# EAGLE design botboardpro-rev1 (EAGLE 4.13)
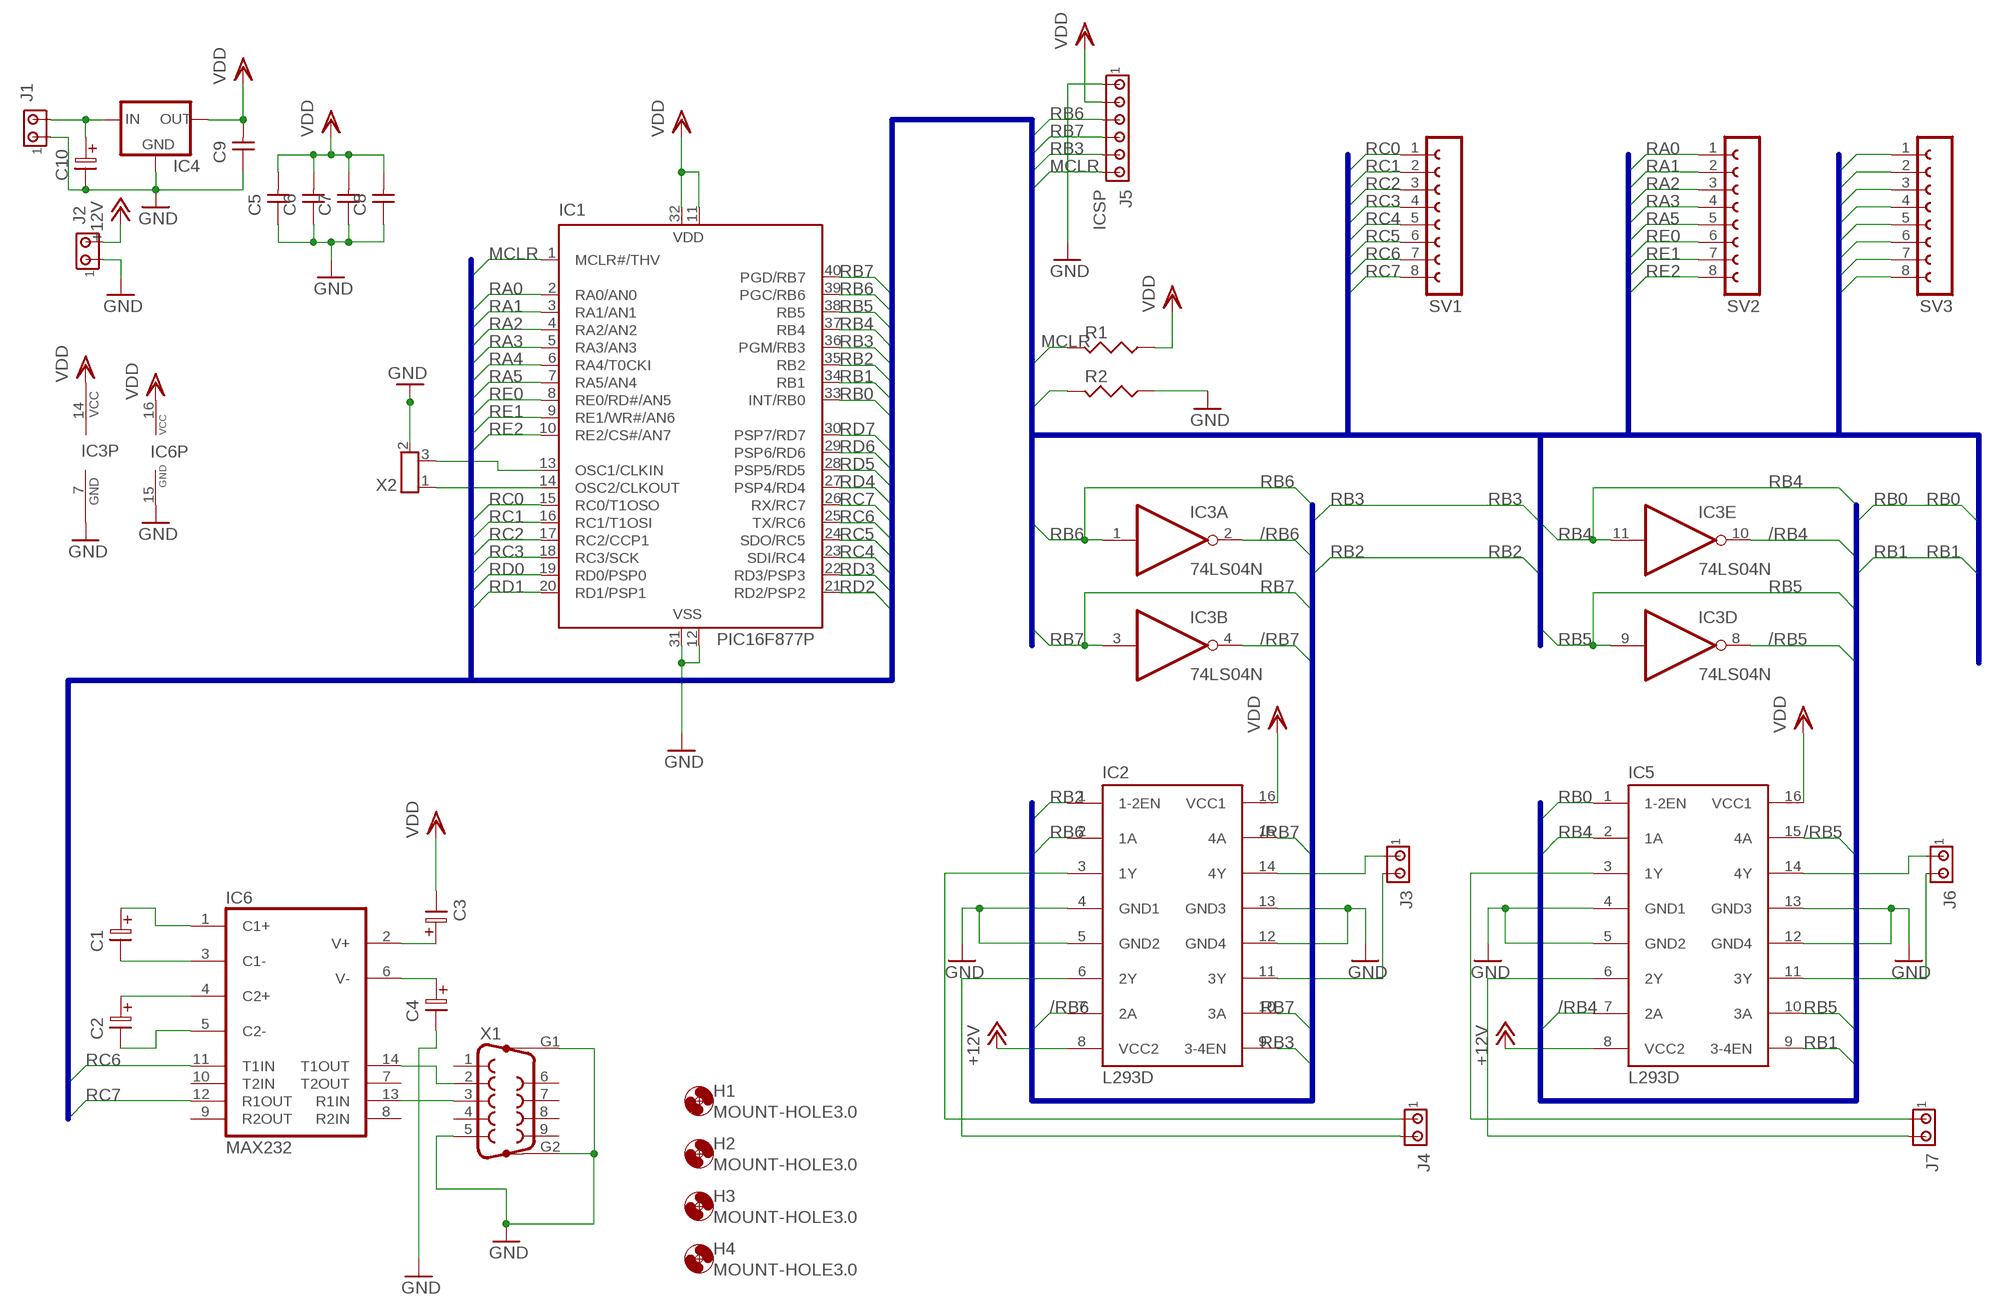
[diagram p0: schematic, sheet 1]

## Parts
C1  ELC-2,5L  [ES-2,5L]
C2  ELC-2,5L  [ES-2,5L]
C3  ELC-2,5L  [ES-2,5L]
C4  ELC-2,5L  [ES-2,5L]
C5  CAPNP-2,5  [C-2,5]
C6  CAPNP-2,5  [C-2,5]
C7  CAPNP-2,5  [C-2,5]
C8  CAPNP-2,5  [C-2,5]
C9  CAPNP-2,5  [C-2,5]
C10  ELC-2,5  [ES-2,5]
H1  MOUNT-HOLE3.0  [3,0]
H2  MOUNT-HOLE3.0  [3,0]
H3  MOUNT-HOLE3.0  [3,0]
H4  MOUNT-HOLE3.0  [3,0]
IC1  PIC16F877P  [DIL40]
IC2  L293D  [DIL16]
IC3  74LS04N  [DIL14]
IC4  78XXS  [78XXS]
IC5  L293D  [DIL16]
IC6  MAX232  [DIL16]
J1  MTA02-100  [10X02MTA]
J2  MTA02-100  [10X02MTA]
J3  MTA02-100  [10X02MTA]
J4  MTA02-100  [10X02MTA]
J5  ICSP  MTA06-100  [10X06MTA]
J6  MTA02-100  [10X02MTA]
J7  MTA02-100  [10X02MTA]
R1  RESUS-S2,5  [RS-2,5]
R2  RESUS-S2,5  [RS-2,5]
SV1  FE08-1  [FE08]
SV2  FE08-1  [FE08]
SV3  FE08-1  [FE08]
X1  F09HP  [F09HP]
X2  RESONZTT  [RESONZTT]

## Nets
+12V: IC2.8(VCC2) IC5.8(VCC2) J2.2
/RB4: IC3.10(E:O) IC5.7(2A)
/RB5: IC3.8(D:O) IC5.15(4A)
/RB6: IC2.7(2A) IC3.2(A:O)
/RB7: IC2.15(4A) IC3.4(B:O)
GND: C4.2 C5.1 C6.1 C7.1 C8.1 C9.1 C10.2 IC1.12(VSS) IC1.31(VSS) IC2.4(GND1) IC2.5(GND2) IC2.12(GND4) IC2.13(GND3) IC3.7(P:GND) IC4.GND IC5.4(GND1) IC5.5(GND2) IC5.12(GND4) IC5.13(GND3) IC6.15(GND) J1.1 J2.1 J5.6 R2.1 X1.5 X1.G1 X1.G2
MCLR: IC1.1(MCLR#/THV) J5.1 R1.2
N$1: C10.1 IC4.IN J1.2
N$2: IC2.14(4Y) J3.1
N$3: IC2.11(3Y) J3.2
N$4: IC2.3(1Y) J4.1
N$5: IC2.6(2Y) J4.2
N$6: IC5.14(4Y) J6.1
N$7: IC5.11(3Y) J6.2
N$8: IC5.3(1Y) J7.1
N$9: IC5.6(2Y) J7.2
N$10: IC1.14(OSC2/CLKOUT) X2.1(X1)
N$11: C2.1 IC6.4(C2+)
N$12: C2.2 IC6.5(C2-)
N$13: C1.2 IC6.3(C1-)
N$14: C1.1 IC6.1(C1+)
N$15: C3.1 IC6.2(V+)
N$16: C4.1 IC6.6(V-)
N$17: IC1.13(OSC1/CLKIN) X2.3(X2)
N$18: IC6.14(T1OUT) X1.2
N$19: IC6.13(R1IN) X1.3
RA0: IC1.2(RA0/AN0) SV2.1
RA1: IC1.3(RA1/AN1) SV2.2
RA2: IC1.4(RA2/AN2) SV2.3
RA3: IC1.5(RA3/AN3) SV2.4
RA4: IC1.6(RA4/T0CKI)
RA5: IC1.7(RA5/AN4) SV2.5
RB0: IC1.33(INT/RB0) IC5.1(1-2EN)
RB1: IC1.34(RB1) IC5.9(3-4EN)
RB2: IC1.35(RB2) IC2.1(1-2EN)
RB3: IC1.36(PGM/RB3) IC2.9(3-4EN) J5.2 R2.2
RB4: IC1.37(RB4) IC3.11(E:I) IC5.2(1A)
RB5: IC1.38(RB5) IC3.9(D:I) IC5.10(3A)
RB6: IC1.39(PGC/RB6) IC2.2(1A) IC3.1(A:I) J5.4
RB7: IC1.40(PGD/RB7) IC2.10(3A) IC3.3(B:I) J5.3
RC0: IC1.15(RC0/T1OSO) SV1.1
RC1: IC1.16(RC1/T1OSI) SV1.2
RC2: IC1.17(RC2/CCP1) SV1.3
RC3: IC1.18(RC3/SCK) SV1.4
RC4: IC1.23(SDI/RC4) SV1.5
RC5: IC1.24(SDO/RC5) SV1.6
RC6: IC1.25(TX/RC6) IC6.11(T1IN) SV1.7
RC7: IC1.26(RX/RC7) IC6.12(R1OUT) SV1.8
RD0: IC1.19(RD0/PSP0) SV3.1
RD1: IC1.20(RD1/PSP1) SV3.2
RD2: IC1.21(RD2/PSP2) SV3.3
RD3: IC1.22(RD3/PSP3) SV3.4
RD4: IC1.27(PSP4/RD4) SV3.5
RD5: IC1.28(PSP5/RD5) SV3.6
RD6: IC1.29(PSP6/RD6) SV3.7
RD7: IC1.30(PSP7/RD7) SV3.8
RE0: IC1.8(RE0/RD#/AN5) SV2.6
RE1: IC1.9(RE1/WR#/AN6) SV2.7
RE2: IC1.10(RE2/CS#/AN7) SV2.8
VDD: C3.2 C5.2 C6.2 C7.2 C8.2 C9.2 IC1.11(VDD) IC1.32(VDD) IC2.16(VCC1) IC3.14(P:VCC) IC4.OUT IC5.16(VCC1) IC6.16(VCC) J5.5 R1.1
Unconnected: IC3.5(C:I) IC3.6(C:O) IC3.12(F:O) IC3.13(F:I) IC6.7(T2OUT) IC6.8(R2IN) IC6.9(R2OUT) IC6.10(T2IN) X1.1 X1.4 X1.6 X1.7 X1.8 X1.9

## Buses
RA[0..5],RB[0..7],RC[0..7],RD[0..7],RE[0..2],MCLR
RB7,RB6,/RB7,/RB6,RB3,RB2
RB5,RB4,/RB5,/RB4,RB0,RB1

## Power pins joined to a net without a drawn wire
GND: X2.2(GND)

## Library data of the parts
C1-C4 = discrete:ELC-2,5L
C5-C9 = discrete:CAPNP-2,5
C10 = discrete:ELC-2,5
H1-H4 = holes:MOUNT-HOLE: MOUNTING HOLE with drill center marker
IC1 = microchip:PIC16F87*: MICROCONTROLLER
IC2 IC5 = st-microelectronics:L293D: PUSH-PULL 4 CHANNEL DRIVER
IC3 = 74xx-us:74*04: Hex INVERTER
IC4 = v-reg:78XXS: VOLTAGE REGULATOR
IC6 = maxim:MAX232: RS232 TRANSEIVER
J1-J4 J6 J7 = con-amp:MTA02-100: AMP connector
J5 = con-amp:MTA06-100: AMP connector
R1 R2 = discrete:RESUS-S2,5
SV1-SV3 = con-lsta:FE08-1: FEMALE HEADER
X1 = con-subd:F09HP: SUB-D
X2 = ADS:RESONZTT

## Board
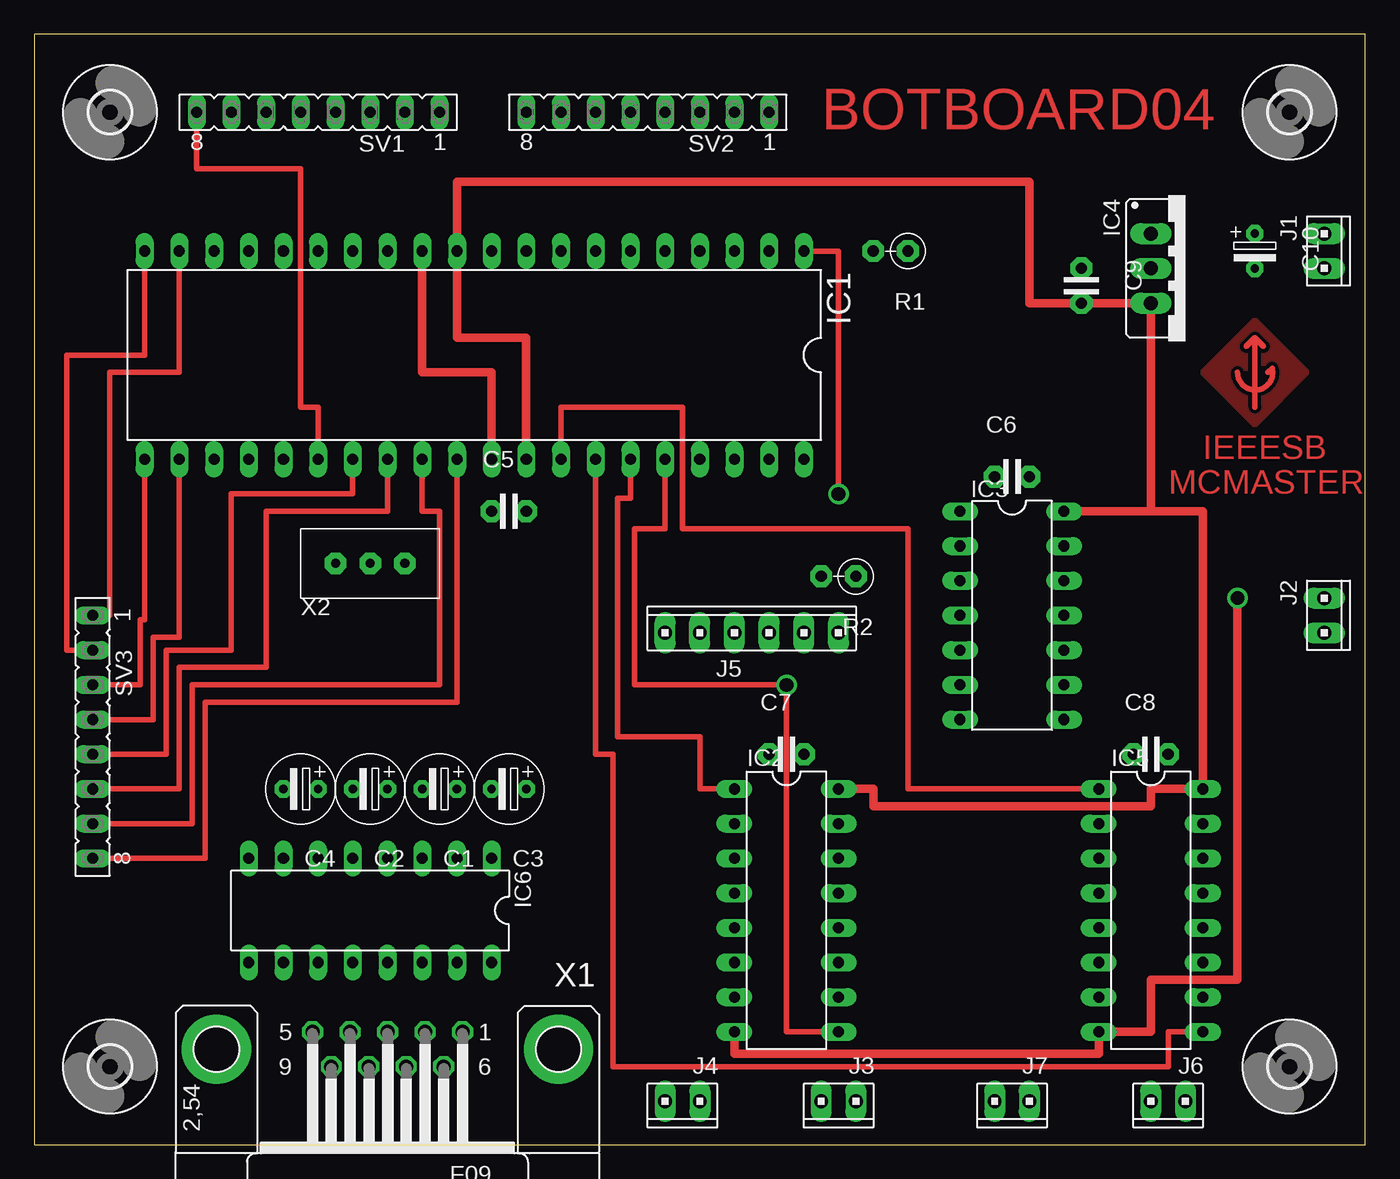
[diagram p1: board, top side]
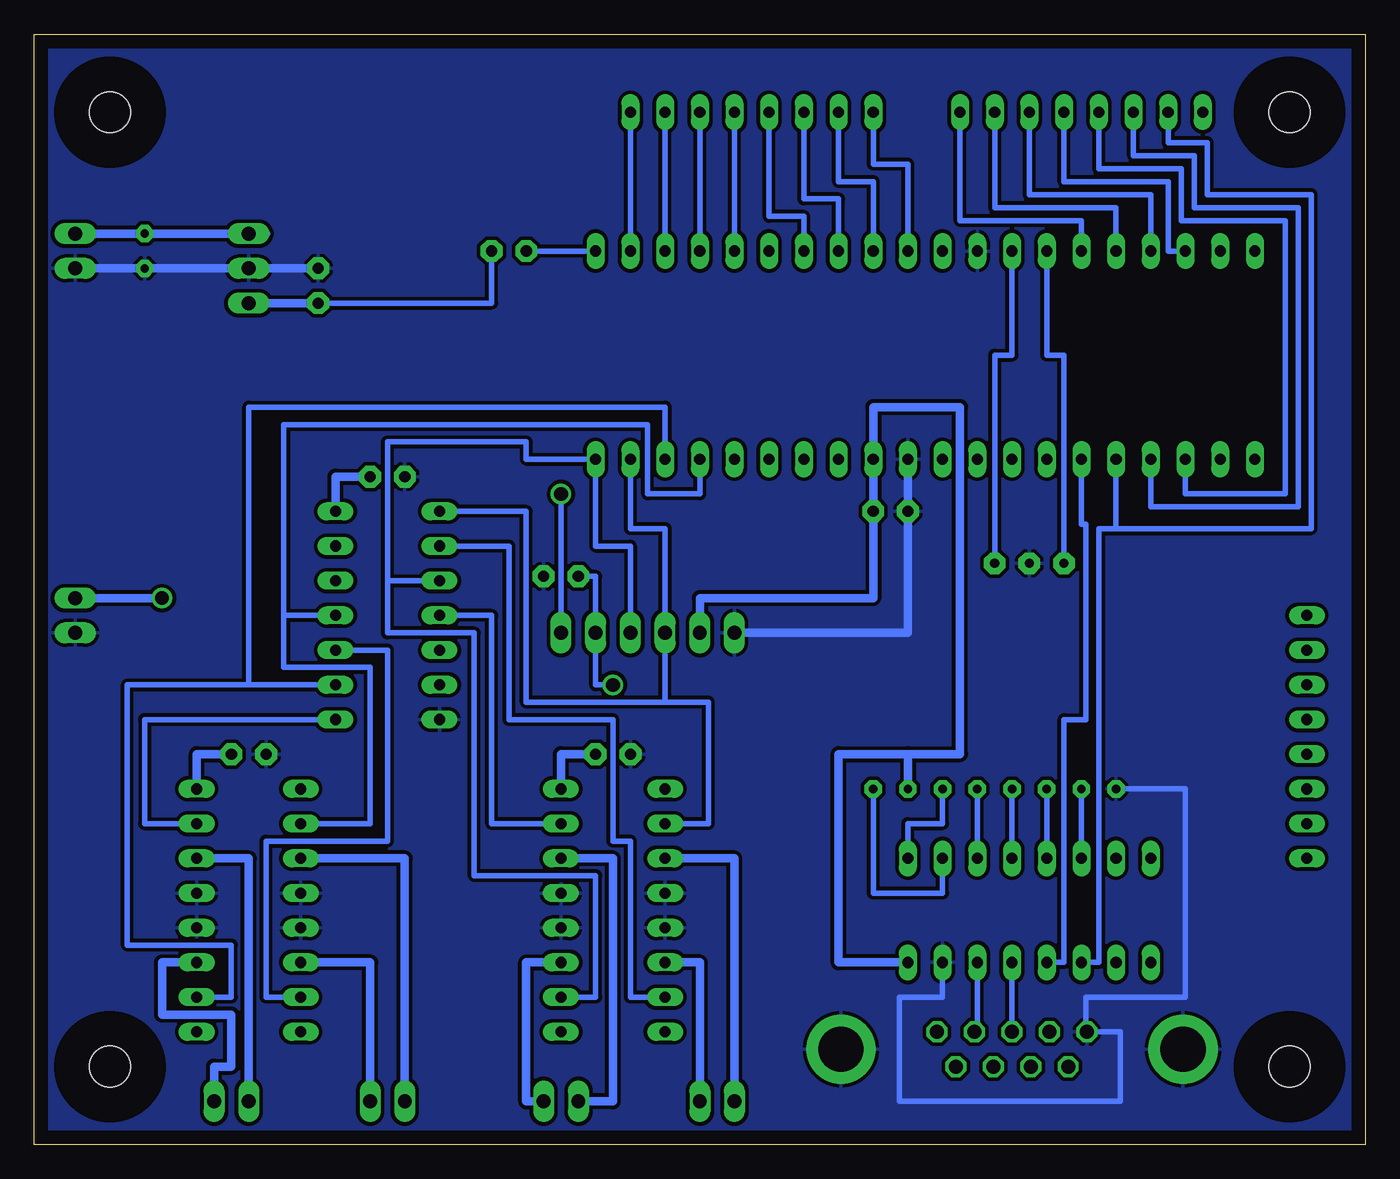
[diagram p2: board, bottom side, seen from below]

Size 97.46 x 81.27 mm. Coordinates in mm from the lower left corner, seen from the top.
Outline: 0,0 97.46,0 97.46,81.27 0,81.27 0,0
Copper layers (1*16): Top 0.035mm / dielectric 1.5mm / Bottom 0.035mm
Design rules "default": minimum track width 10mil, minimum drill 24mil, track to track 11mil, track to pad 11mil, pad to pad 11mil, via to via 11mil, smd to smd 8mil, copper to edge 40mil, drill to drill 8mil, minimum pad ring 10mil, minimum via ring 8mil, stop-mask expansion 4mil, vias tented up to drill 0mil, thermal gap 10mil

### Footprints (pad centres in the part's own frame; a part is rotated, then mirrored left to right if it is on the bottom)
ES-2,5L = drill 0.61 pad 1.27 octagon: 1 0,0; 2 2.54,0
C-2,5 = drill 0.813 pad 1.6 octagon: 1 -1.27,0; 2 1.27,0
ES-2,5 = drill 0.61 pad 1.27 octagon: 1 -1.27,0; 2 1.27,0
3,0 = hole 3: 0,0
DIL40 = drill 0.813 long: 1 -24.13,-7.62; 2 -21.59,-7.62; 3 -19.05,-7.62; 4 -16.51,-7.62; 5 -13.97,-7.62; 6 -11.43,-7.62; 7 -8.89,-7.62; 8 -6.35,-7.62; 9 -3.81,-7.62; 10 -1.27,-7.62; 11 1.27,-7.62; 12 3.81,-7.62; 13 6.35,-7.62; 14 8.89,-7.62; 15 11.43,-7.62; 16 13.97,-7.62; 17 16.51,-7.62; 18 19.05,-7.62; 19 21.59,-7.62; 20 24.13,-7.62; 21 24.13,7.62; 22 21.59,7.62; 23 19.05,7.62; 24 16.51,7.62; 25 13.97,7.62; 26 11.43,7.62; 27 8.89,7.62; 28 6.35,7.62; 29 3.81,7.62; 30 1.27,7.62; 31 -1.27,7.62; 32 -3.81,7.62; 33 -6.35,7.62; 34 -8.89,7.62; 35 -11.43,7.62; 36 -13.97,7.62; 37 -16.51,7.62; 38 -19.05,7.62; 39 -21.59,7.62; 40 -24.13,7.62
DIL16 = drill 0.813 long: 1 -8.89,-3.81; 2 -6.35,-3.81; 3 -3.81,-3.81; 4 -1.27,-3.81; 5 1.27,-3.81; 6 3.81,-3.81; 7 6.35,-3.81; 8 8.89,-3.81; 9 8.89,3.81; 10 6.35,3.81; 11 3.81,3.81; 12 1.27,3.81; 13 -1.27,3.81; 14 -3.81,3.81; 15 -6.35,3.81; 16 -8.89,3.81
DIL14 = drill 0.813 long: 1 -7.62,-3.81; 2 -5.08,-3.81; 3 -2.54,-3.81; 4 0,-3.81; 5 2.54,-3.81; 6 5.08,-3.81; 7 7.62,-3.81; 8 7.62,3.81; 9 5.08,3.81; 10 2.54,3.81; 11 0,3.81; 12 -2.54,3.81; 13 -5.08,3.81; 14 -7.62,3.81
78XXS = drill 1.016 long: GND 0,-2.54; IN -2.54,-2.54; OUT 2.54,-2.54
10X02MTA = drill 1.016 long: 1 1.27,0; 2 -1.27,0
10X06MTA = drill 1.016 long: 1 6.35,0; 2 3.81,0; 3 1.27,0; 4 -1.27,0; 5 -3.81,0; 6 -6.35,0
RS-2,5 = drill 0.813 pad 1.6 octagon: 1 0,0; 2 2.54,0
FE08 = drill 0.813 long: 1 -8.89,0; 2 -6.35,0; 3 -3.81,0; 4 -1.27,0; 5 1.27,0; 6 3.81,0; 7 6.35,0; 8 8.89,0
F09HP = drill 1.016 octagon: 1 -5.486,-1.27; 2 -2.743,-1.27; 3 0,-1.27; 4 2.743,-1.27; 5 5.486,-1.27; 6 -4.115,1.27; 7 -1.372,1.27; 8 1.372,1.27; 9 4.115,1.27 | drill 3.302 pad 5.08 round: G1 -12.522,0; G2 12.522,0
RESONZTT = drill 0.66 pad 1.575 octagon: 1 0,0; 2 2.54,0; 3 5.08,0

### Placement (x,y rotation side)
C1  30.95,26.03 180 top
C2  25.87,26.03 180 top
C3  36.03,26.03 180 top
C4  20.79,26.03 180 top
C5  34.76,46.35 0 top
C6  71.59,48.89 0 top
C7  55.08,28.57 0 top
C8  81.75,28.57 0 top
C9  76.67,62.86 270 top
C10  89.37,65.4 270 top
H1  5.55,5.71 0 top
H2  91.91,75.56 0 top
H3  91.91,5.71 0 top
H4  5.55,75.56 0 top
IC1  32.22,57.78 180 top
IC2  55.08,17.14 270 top
IC3  71.59,38.73 270 top
IC4  84.29,64.13 270 top
IC5  81.75,17.14 270 top
IC6  24.6,17.14 180 top
J1  94.45,65.4 270 top
J2  94.45,38.73 270 top
J3  58.89,3.17 180 top
J4  47.46,3.17 180 top
J5  52.54,37.46 0 top
J6  83.02,3.17 180 top
J7  71.59,3.17 180 top
R1  63.97,65.4 180 top
R2  60.16,41.59 180 top
SV1  20.79,75.56 180 top
SV2  44.92,75.56 180 top
SV3  4.28,29.84 270 top
X1  25.87,6.98 180 top
X2  22.06,42.54 0 top

### Tracks (layer width: path | path; a pad name or v marks a point on that pad's centre or on a via)
+12V  (via drill 1)
  Top 0.61: IC2.8 51.27,6.66 77.94,6.66 IC5.8 81.75,8.25 81.75,12.06 88.1,12.06 v88.1,40
  Bottom 0.61: v88.1,40 J2.2
/RB4
  Bottom 0.406: IC5.7 80.48,10.79 80.48,22.22 71.59,22.22 71.59,36.19 IC3.10
/RB5
  Bottom 0.406: IC3.8 89.37,31.11 89.37,23.49 IC5.15
/RB6
  Bottom 0.406: IC3.2 62.7,43.81 62.7,31.11 55.08,31.11 55.08,22.22 53.81,22.22 53.81,10.79 IC2.7
/RB7
  Bottom 0.406: IC3.4 63.97,38.73 63.97,23.49 IC2.15
GND
  Top 0.61: IC1.31 33.49,56.51 28.41,56.51 IC1.12
  Bottom 0.406: C4.2 13.17,26.03 13.17,10.79 20.47,10.79 20.47,8.25 | IC6.15 30.95,10.79 34.12,10.79 34.12,3.17 17.93,3.17 17.93,8.25 20.47,8.25 | 20.47,8.25 X1.5
  Bottom 0.61: J5.6 33.49,37.46 C5.1 | C5.1 IC1.31 C5.1 | C10.2 IC4.GND C9.1 | C10.2 J1.1 C10.2
  pour Bottom: 0.15,81.27 0.15,-0.01 97.31,-0.01 97.31,81.27
MCLR  (via drill 1)
  Top 0.406: v58.89,47.62 58.89,65.4 IC1.1
  Bottom 0.406: J5.1 v58.89,47.62 | IC1.1 R1.2
N$1
  Bottom 0.61: IC4.IN C10.1 | C10.1 J1.2 | IC4.IN C10.1 | IC4.IN 80.48,66.67
N$2
  Bottom 0.61: J3.1 55.08,3.17 55.08,20.95 IC2.14
N$3
  Bottom 0.61: IC2.11 61.43,13.33 61.43,3.17 J3.2
N$4
  Bottom 0.61: IC2.3 46.19,20.95 J4.1
N$5
  Bottom 0.61: J4.2 48.73,13.33 IC2.6
N$6
  Bottom 0.61: IC5.14 81.75,20.95 J6.1
N$7
  Bottom 0.61: IC5.11 88.1,13.33 88.1,9.52 83.02,9.52 83.02,5.71 84.29,5.71 J6.2
N$8
  Bottom 0.61: IC5.3 70.32,20.95 J7.1
N$9
  Bottom 0.61: J7.2 72.86,13.33 IC5.6
N$10
  Bottom 0.406: X2.1 22.06,57.78 23.33,57.78 IC1.14
N$11
  Bottom 0.406: IC6.4 C2.1
N$12
  Bottom 0.406: IC6.5 C2.2
N$13
  Bottom 0.406: IC6.3 C1.2
N$14
  Bottom 0.406: C1.1 30.95,23.49 33.49,23.49 IC6.1
N$15
  Bottom 0.406: C3.1 36.03,18.41 30.95,18.41 IC6.2
N$16
  Bottom 0.406: IC6.6 C4.1
N$17
  Bottom 0.406: X2.3 27.14,57.78 25.87,57.78 IC1.13
N$18
  Bottom 0.406: X1.2 28.41,8.25 IC6.14
N$19
  Bottom 0.406: X1.3 IC6.13
N$20
  pour Top: 89.37,60.32 85.56,56.51 89.37,52.7 93.18,56.51
N$21
  Top 0.406: 89.37,53.97 89.37,59.05 | 89.37,59.05 88.73,58.41 | 89.37,59.05 90,58.41
N$22
  Top 0.406: 88.1,56.51 arc194 90.64,56.83 90.32,56.51
RA0
  Bottom 0.406: IC1.2 SV2.1
RA1
  Bottom 0.406: IC1.3 SV2.2
RA2
  Bottom 0.406: IC1.4 SV2.3
RA3
  Bottom 0.406: IC1.5 SV2.4
RA5
  Bottom 0.406: IC1.7 41.11,67.94 43.65,67.94 SV2.5
RB0
  Top 0.406: IC5.1 63.97,26.03 63.97,45.08 47.46,45.08 47.46,53.97 38.57,53.97 IC1.33
RB1
  Top 0.406: IC5.9 83.02,8.25 83.02,5.71 42.38,5.71 42.38,28.57 41.11,28.57 IC1.34
RB2
  Top 0.406: IC2.1 48.73,26.03 48.73,29.84 42.7,29.84 42.7,47.3 43.65,47.3 IC1.35
RB3  (via drill 1)
  Top 0.406: IC2.9 55.08,8.25 v55.08,33.65 43.97,33.65 43.97,45.08 46.19,45.08 IC1.36
  Bottom 0.406: v55.08,33.65 56.35,33.65 J5.2 56.35,41.59 R2.2
RB4
  Bottom 0.406: IC5.2 72.86,23.49 72.86,34.92 79.21,34.92 79.21,38.73 | 79.21,38.73 IC3.11 | 79.21,38.73 79.21,52.7 52.54,52.7 52.54,47.62 48.73,47.62 IC1.37
RB5
  Bottom 0.406: IC5.10 83.02,10.79 83.02,14.6 90.64,14.6 90.64,33.65 IC3.9 81.75,33.65 81.75,53.97 51.27,53.97 IC1.38
RB6
  Bottom 0.406: IC3.1 61.43,46.35 61.43,32.38 51.27,32.38 | IC2.2 48.09,23.49 48.09,32.38 51.27,32.38 | 51.27,45.08 J5.4 | IC1.39 53.81,45.08 51.27,45.08 | 51.27,32.38 51.27,45.08
RB7
  Bottom 0.406: 71.59,41.27 IC3.3 | IC2.10 56.35,10.79 56.35,19.68 65.24,19.68 65.24,37.46 71.59,37.46 71.59,41.27 | J5.3 53.81,43.81 56.35,43.81 IC1.40 61.43,50.16 61.43,51.43 71.59,51.43 71.59,41.27
RC0
  Bottom 0.406: IC1.15 20.79,67.62 29.68,67.62 SV1.1
RC1
  Bottom 0.406: IC1.16 18.25,68.57 27.14,68.57 SV1.2
RC2
  Bottom 0.406: SV1.3 24.6,69.53 15.71,69.53 IC1.17
RC3
  Bottom 0.406: SV1.4 22.06,70.48 14.44,70.48 14.44,65.4 IC1.18
RC4
  Bottom 0.406: SV1.5 19.52,71.43 13.49,71.43 13.49,67.62 5.87,67.62 5.87,47.62 13.17,47.62 IC1.23
RC5
  Bottom 0.406: SV1.6 16.98,72.38 12.54,72.38 12.54,68.57 4.92,68.57 4.92,46.67 15.71,46.67 IC1.24
RC6
  Bottom 0.406: IC6.11 19.52,13.33 19.52,45.08 18.25,45.08 | 18.25,45.08 IC1.25 | 18.25,45.08 3.96,45.08 3.96,69.53 11.58,69.53 11.58,73.34 14.44,73.34 SV1.7
RC7
  Top 0.406: IC1.26 20.79,53.97 19.52,53.97 19.52,71.43 11.9,71.43 SV1.8
  Bottom 0.406: IC6.12 22.06,13.33 22.06,31.11 20.47,31.11 20.47,45.4 20.79,45.4 IC1.26
RD0
  Top 0.406: IC1.19 10.63,56.51 5.55,56.51 5.55,38.73 SV3.1
RD1
  Top 0.406: SV3.2 2.38,36.19 2.38,57.78 8.09,57.78 IC1.20
RD2
  Top 0.406: SV3.3 7.77,33.65 7.77,38.41 8.09,38.41 IC1.21
RD3
  Top 0.406: SV3.4 8.73,31.11 8.73,37.14 10.63,37.14 IC1.22
RD4
  Top 0.406: SV3.5 9.68,28.57 9.68,36.19 14.44,36.19 14.44,47.62 23.33,47.62 IC1.27
RD5
  Top 0.406: SV3.6 10.63,26.03 10.63,34.92 16.98,34.92 16.98,46.35 25.87,46.35 IC1.28
RD6
  Top 0.406: SV3.7 11.58,23.49 11.58,33.65 29.68,33.65 29.68,46.35 28.41,46.35 IC1.29
RD7
  Top 0.406: IC1.30 30.95,32.38 12.54,32.38 12.54,20.95 SV3.8
RE0
  Bottom 0.406: SV2.6 41.11,69.21 38.57,69.21 IC1.8
RE1
  Bottom 0.406: IC1.9 36.03,70.48 38.57,70.48 SV2.7
RE2
  Bottom 0.406: IC1.10 33.49,71.75 36.03,71.75 SV2.8
VDD
  Top 0.61: 81.75,46.35 85.56,46.35 IC5.16 81.75,26.03 81.75,24.76 61.43,24.76 61.43,26.03 IC2.16 | 81.75,46.35 IC3.14 | 81.75,46.35 IC4.OUT 72.86,61.59 72.86,70.48 30.95,70.48 IC1.11 30.95,59.05 36.03,59.05 IC1.32
  Bottom 0.406: R1.1 63.97,61.59 C9.2
  Bottom 0.61: J5.5 48.73,40 36.03,40 C5.2 | IC1.32 C5.2 | IC6.16 38.57,13.33 38.57,28.57 | 38.57,28.57 33.49,28.57 C3.2 | IC1.32 C5.2 | C6.2 75.4,48.89 IC3.14 | C7.2 58.89,28.57 IC2.16 | C8.2 85.56,28.57 IC5.16 | IC1.32 36.03,53.97 29.68,53.97 29.68,28.57 38.57,28.57 | IC4.OUT C9.2

### Text on the board
Top: BOTBOARD04 | IEEESB | MCMASTER